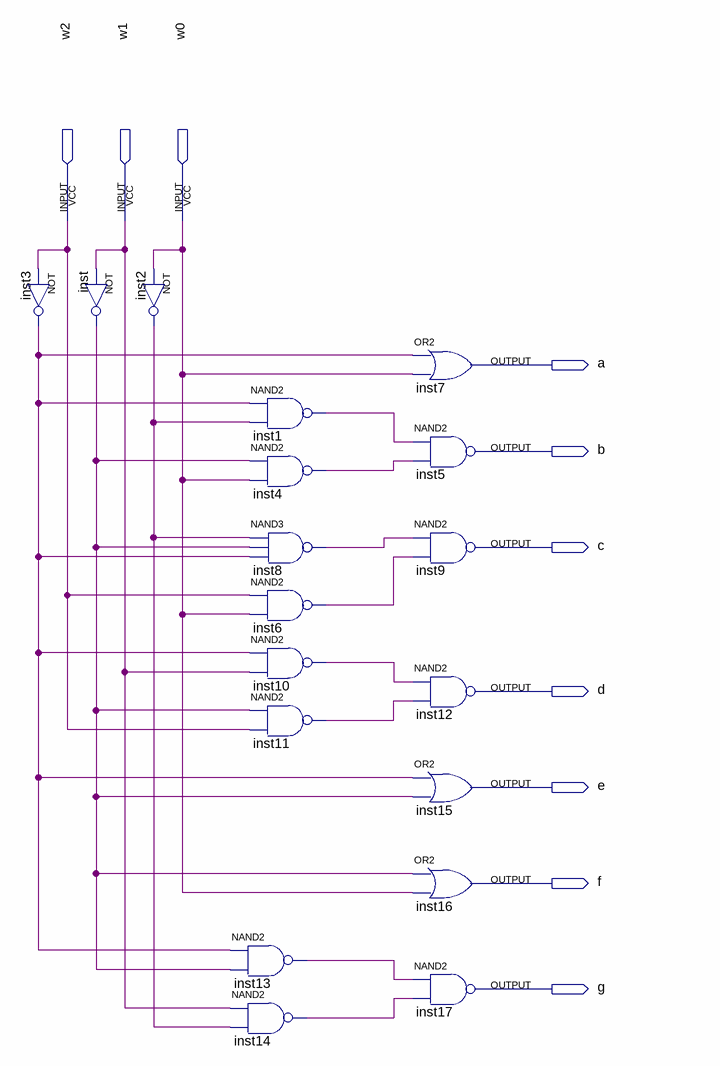
[diagram p0: schematic sheet]
// Quartus schematic WhatWonTo7Segment.bdf as structural Verilog: 18 symbols, 10 pins
module WhatWonTo7Segment (
  input  w2,
  input  w1,
  input  w0,
  output a,
  output b,
  output c,
  output d,
  output e,
  output f,
  output g
);

  wire inst1_out, inst2_out, inst3_out, inst4_out, inst6_out, inst8_out, inst10_out, inst11_out, inst13_out,
       inst14_out, inst_out;

  not inst3 (inst3_out, w2);
  not inst (inst_out, w1);
  not inst2 (inst2_out, w0);
  nand inst1 (inst1_out, inst3_out, inst2_out);
  nand inst4 (inst4_out, inst_out, w0);
  nand inst8 (inst8_out, inst2_out, inst_out, inst3_out);
  nand inst6 (inst6_out, w2, w0);
  nand inst10 (inst10_out, inst3_out, w1);
  nand inst11 (inst11_out, inst_out, w2);
  nand inst13 (inst13_out, inst3_out, inst_out);
  nand inst14 (inst14_out, w1, inst2_out);
  or inst7 (a, inst3_out, w0);
  nand inst5 (b, inst1_out, inst4_out);
  nand inst9 (c, inst8_out, inst6_out);
  nand inst12 (d, inst10_out, inst11_out);
  or inst15 (e, inst3_out, inst_out);
  or inst16 (f, inst_out, w0);
  nand inst17 (g, inst13_out, inst14_out);
endmodule
